# Altium schematic sheet _Geeky_ Sheet1 copy_2023-02-18.schdoc
size 440 x 310 mm
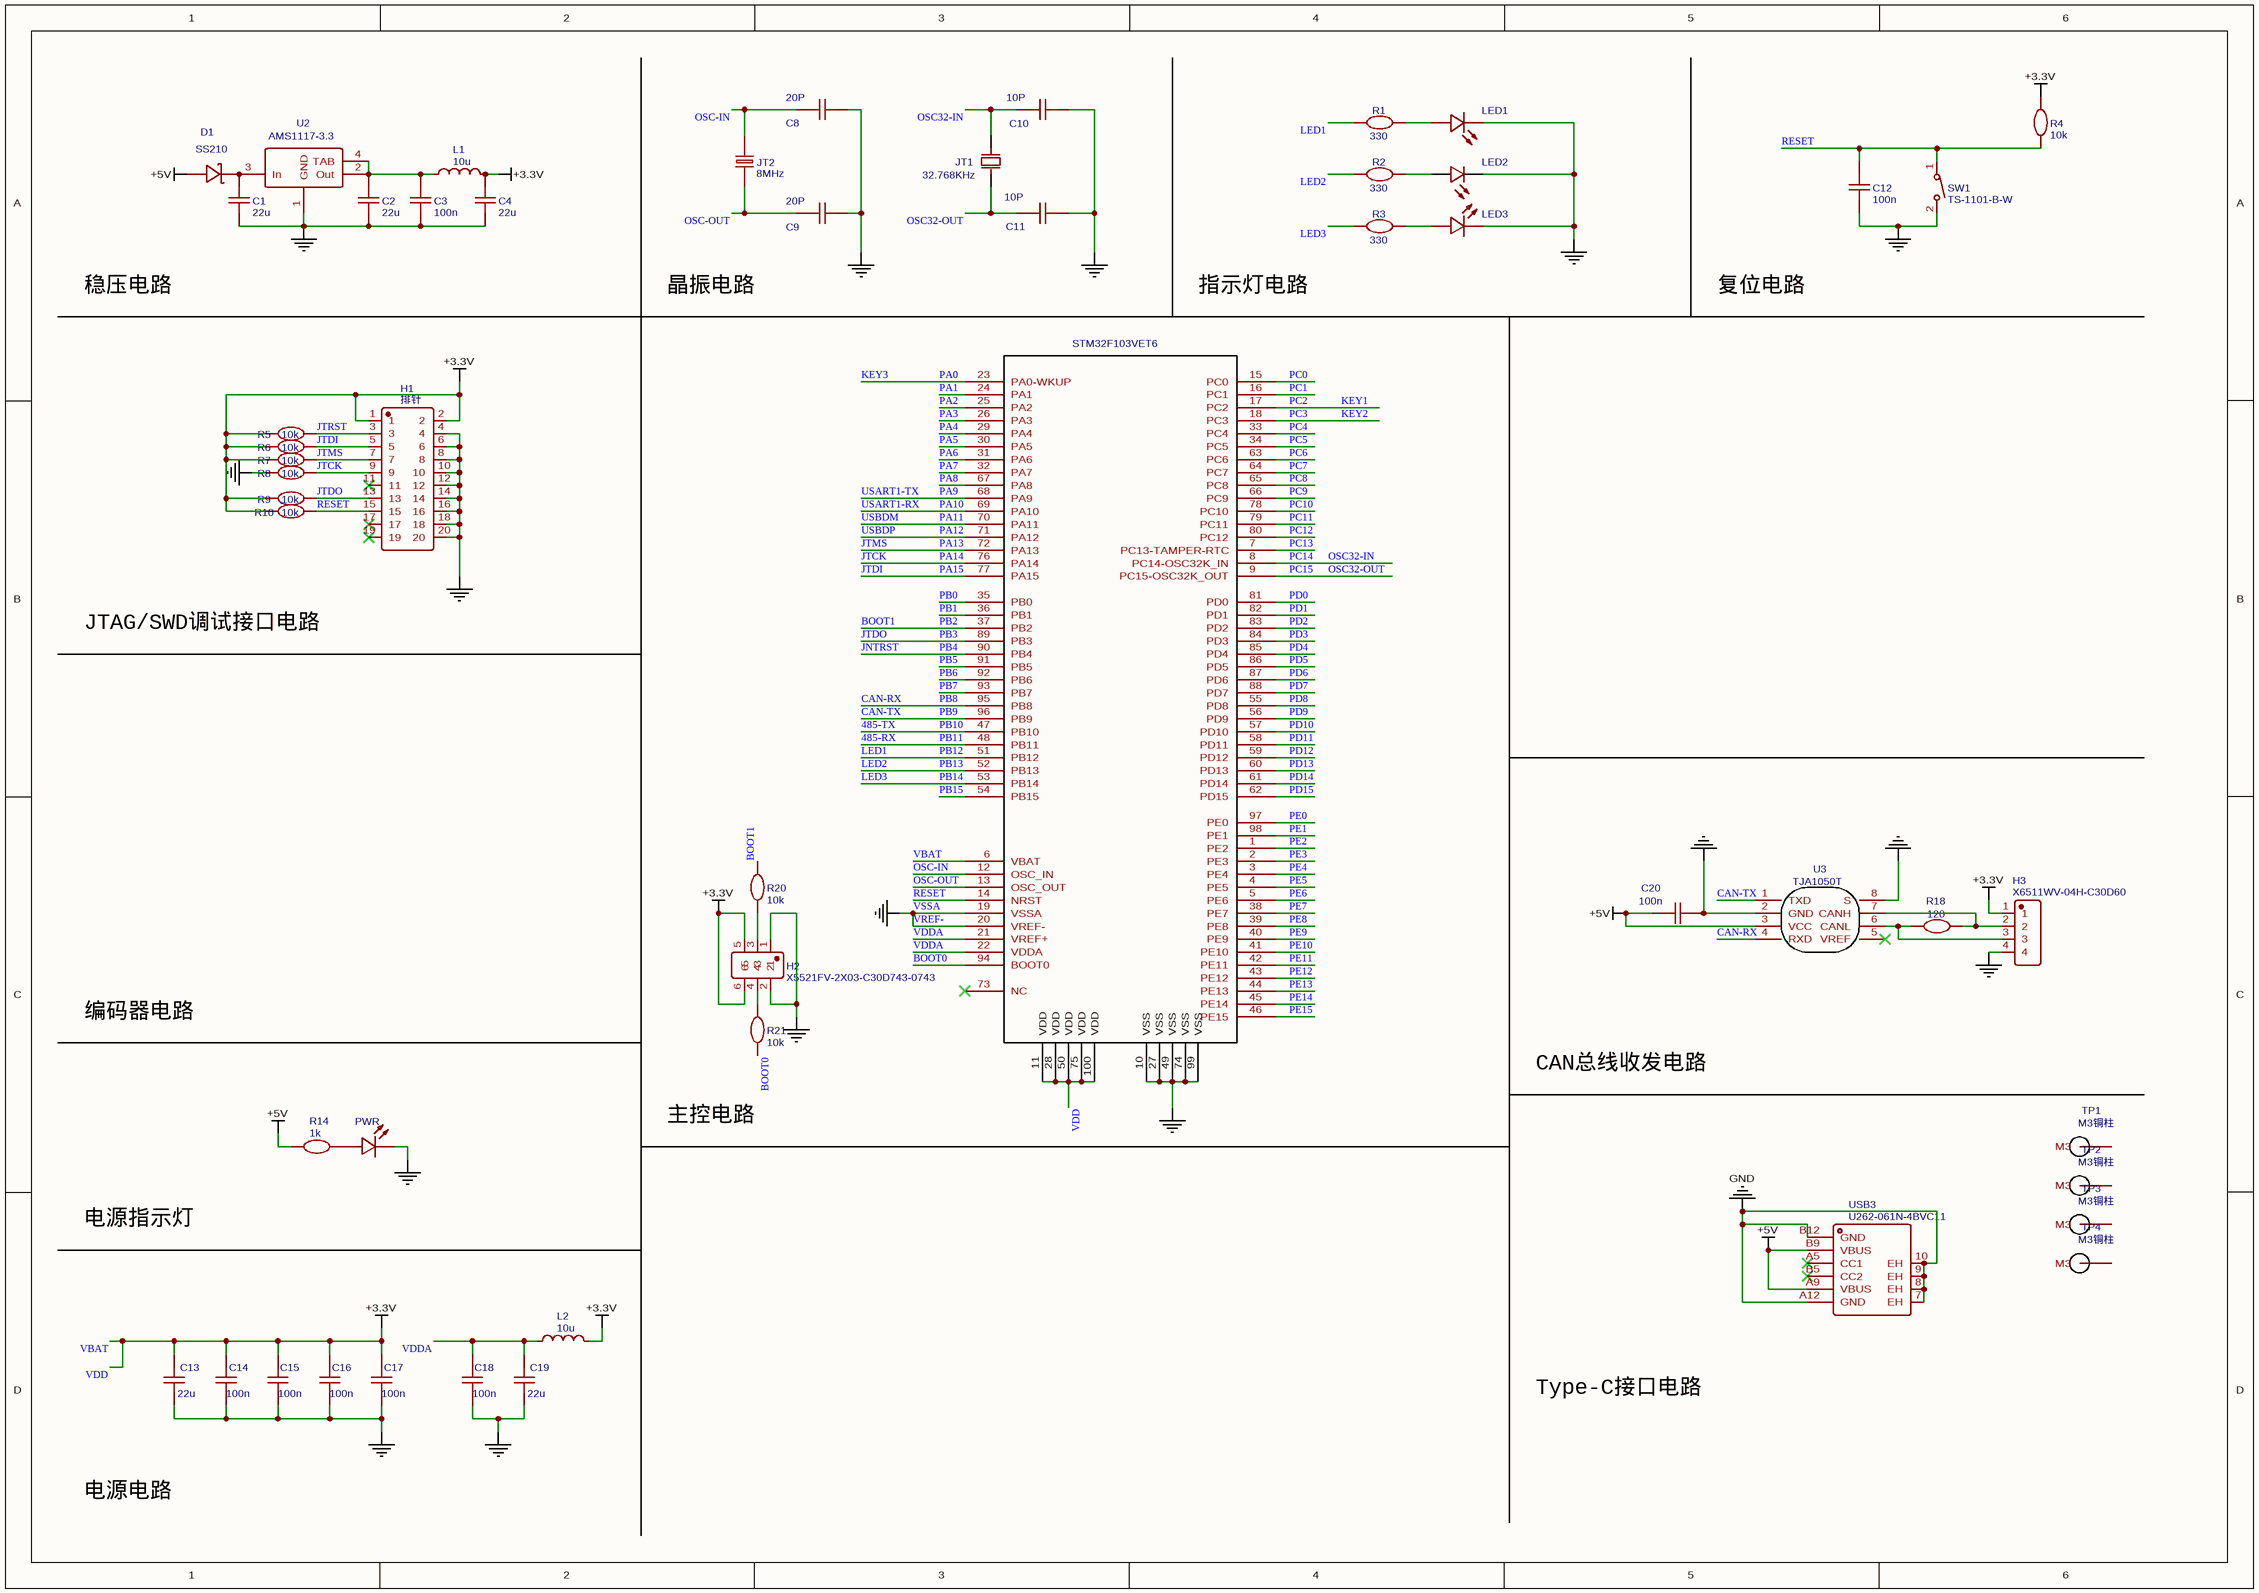
[diagram p0: _Geeky_ Sheet1 copy_2023-02-18.schdoc]

## Parts
C1  22u  [0805]
C2  22u  [0805]
C3  100n  [0805]
C4  22u  [0805]
C8  20P  [0805]
C9  20P  [0805]
C10  10P  [0805]
C11  10P  [0805]
C12  100n  [0805]
C13  22u  [0805]
C14  100n  [0805]
C15  100n  [0805]
C16  100n  [0805]
C17  100n  [0805]
C18  100n  [0805]
C19  22u  [0805]
C20  100n  [0805]
D1  SS210  [SMA_L4.3-W2.6-LS5.2-FD]
H1  排针  [HDR-TH_20P-P2.54-V-M-R2-C10-S2.54-3]
H2  X5521FV-2X03-C30D743-0743  [HDR-TH_6P-P2.54-V-F-R2-C3-S2.54-3]
H3  X6511WV-04H-C30D60  [HDR-TH_4P-P2.54-V-M]
JT1  32.768KHz  [OSC-SMD_L3.2-W1.5]
JT2  8MHz  [HC-49US_L11.5-W4.5-P4.88]
L1  10u  [0805]
L2  10u  [0805]
LED1  17-21SUYC/TR8  [LED0805-RD]  (value not drawn)
LED2  17-21/BHC-XL2M2TY/3T  [LED0805-RD]  (value not drawn)
LED3  D-W080508W1-KS2  [LED-0805]  (value not drawn)
PWR  17-21SURC/S530-A2/TR8  [LED-0805]  (value not drawn)
R1  330  [0805]
R2  330  [0805]
R3  330  [0805]
R4  10k  [0805]
R5  10k  [0805]
R6  10k  [0805]
R7  10k  [0805]
R8  10k  [0805]
R9  10k  [0805]
R10  10k  [0805]
R14  1k  [0805]
R18  120  [0805]
R20  10k  [0805]
R21  10k  [0805]
SW1  TS-1101-B-W  [KEY-SMD_2P-L6.0-W3.6-P7.4-LS8.0-L]
TP1  M3铜柱  [M3铜柱_LCEDA]
TP2  M3铜柱  [M3铜柱_LCEDA]
TP3  M3铜柱  [M3铜柱_LCEDA]
TP4  M3铜柱  [M3铜柱_LCEDA]
U1  STM32F103VET6  [LQFP-100_L14.0-W14.0-P0.50-LS16.0-BL]
U2  AMS1117-3.3  [SOT-223_L6.5-W3.5-P2.30-LS7.0-BR]
U3  TJA1050T  [SOIC-8_L5.0-W4.0-P1.27-LS6.0-BL]
USB3  U262-061N-4BVC11  [USB-SMD_U262-061N-4BVC11]

## Nets
+5V: C20.1 D1.1(A) R14.1 U3.3(VCC) USB3.A9(VBUS) USB3.B9(VBUS)
VBAT: C4.1 C13.2 C14.2 C15.2 C16.2 C17.2 H1.1 H1.2 H2.5 H2.6 H3.1 L1.2 L2.2 R4.2 R5.2 R6.2 R7.2 R9.2 R10.2 U1.6(VBAT) U1.11(VDD) U1.28(VDD) U1.50(VDD) U1.75(VDD) U1.100(VDD)  [also labelled +3.3V, VDD]
VREF-: C1.2 C2.2 C3.2 C4.2 C8.1 C9.1 C10.1 C11.1 C12.2 C13.1 C14.1 C15.1 C16.1 C17.1 C18.1 C19.1 C20.2 H1.4 H1.6 H1.8 H1.10 H1.12 H1.14 H1.16 H1.18 H1.20 H2.1 H2.2 H3.4 LED1.1(-) LED2.1(-) LED3.2(K) PWR.2(K) R8.2 SW1.2 U1.10(VSS) U1.19(VSSA) U1.20(VREF-) U1.27(VSS) U1.49(VSS) U1.74(VSS) U1.99(VSS) U2.1(GND) U3.2(GND) U3.8(S) USB3.7(EH) USB3.8(EH) USB3.9(EH) USB3.10(EH) USB3.A12(GND) USB3.B12(GND)  [also labelled GND, VSSA]
485-RX: U1.48(PB11)  [also labelled PB11]
485-TX: U1.47(PB10)  [also labelled PB10]
BOOT0: R21.1 U1.94(BOOT0)
BOOT1: R20.2 U1.37(PB2)  [also labelled PB2]
CAN-RX: U1.95(PB8) U3.4(RXD)  [also labelled PB8]
CAN-TX: U1.96(PB9) U3.1(TXD)  [also labelled PB9]
JNTRST: U1.90(PB4)  [also labelled PB4]
JTCK: H1.9 R8.1 U1.76(PA14)  [also labelled PA14]
JTDI: H1.5 R6.1 U1.77(PA15)  [also labelled PA15]
JTDO: H1.13 R9.1 U1.89(PB3)  [also labelled PB3]
JTMS: H1.7 R7.1 U1.72(PA13)  [also labelled PA13]
JTRST: H1.3 R5.1
KEY1: U1.17(PC2)  [also labelled PC2]
KEY2: U1.18(PC3)  [also labelled PC3]
KEY3: U1.23(PA0-WKUP)  [also labelled PA0]
LED1: R1.1 U1.51(PB12)  [also labelled PB12]
LED2: R2.1 U1.52(PB13)  [also labelled PB13]
LED3: R3.1 U1.53(PB14)  [also labelled PB14]
OSC32-IN: C10.2 JT1.2(OSC2) U1.8(PC14-OSC32K_IN)  [also labelled PC14]
OSC32-OUT: C11.2 JT1.1(OSC1) U1.9(PC15-OSC32K_OUT)  [also labelled PC15]
OSC-IN: C8.2 JT2.2 U1.12(OSC_IN)
OSC-OUT: C9.2 JT2.1 U1.13(OSC_OUT)
PA1: U1.24(PA1)
PA2: U1.25(PA2)
PA3: U1.26(PA3)
PA4: U1.29(PA4)
PA5: U1.30(PA5)
PA6: U1.31(PA6)
PA7: U1.32(PA7)
PA8: U1.67(PA8)
PA9: U1.68(PA9)  [also labelled USART1-TX]
PA10: U1.69(PA10)  [also labelled USART1-RX]
PA11: U1.70(PA11)  [also labelled USBDM]
PA12: U1.71(PA12)  [also labelled USBDP]
PB0: U1.35(PB0)
PB1: U1.36(PB1)
PB5: U1.91(PB5)
PB6: U1.92(PB6)
PB7: U1.93(PB7)
PB15: U1.54(PB15)
PC0: U1.15(PC0)
PC1: U1.16(PC1)
PC4: U1.33(PC4)
PC5: U1.34(PC5)
PC6: U1.63(PC6)
PC7: U1.64(PC7)
PC8: U1.65(PC8)
PC9: U1.66(PC9)
PC10: U1.78(PC10)
PC11: U1.79(PC11)
PC12: U1.80(PC12)
PC13: U1.7(PC13-TAMPER-RTC)
PD0: U1.81(PD0)
PD1: U1.82(PD1)
PD2: U1.83(PD2)
PD3: U1.84(PD3)
PD4: U1.85(PD4)
PD5: U1.86(PD5)
PD6: U1.87(PD6)
PD7: U1.88(PD7)
PD8: U1.55(PD8)
PD9: U1.56(PD9)
PD10: U1.57(PD10)
PD11: U1.58(PD11)
PD12: U1.59(PD12)
PD13: U1.60(PD13)
PD14: U1.61(PD14)
PD15: U1.62(PD15)
PE0: U1.97(PE0)
PE1: U1.98(PE1)
PE2: U1.1(PE2)
PE3: U1.2(PE3)
PE4: U1.3(PE4)
PE5: U1.4(PE5)
PE6: U1.5(PE6)
PE7: U1.38(PE7)
PE8: U1.39(PE8)
PE9: U1.40(PE9)
PE10: U1.41(PE10)
PE11: U1.42(PE11)
PE12: U1.43(PE12)
PE13: U1.44(PE13)
PE14: U1.45(PE14)
PE15: U1.46(PE15)
RESET: C12.1 H1.15 R4.1 R10.1 SW1.1 U1.14(NRST)
VDDA: C18.2 C19.2 L2.1 U1.21(VREF+) U1.22(VDDA)
NetC1_1: C1.1 D1.2(K) U2.3(In)
NetC2_1: C2.1 C3.1 L1.1 U2.2(Out) U2.4(TAB)
NetH2_3: H2.3 R20.1
NetH2_4: H2.4 R21.2
NetH3_2: H3.2 R18.2 U3.7(CANH)
NetH3_3: H3.3 R18.1 U3.6(CANL)
NetLED1_2: LED1.2(+) R1.2
NetLED2_2: LED2.2(+) R2.2
NetLED3_1: LED3.1(A) R3.2
NetPWR_1: PWR.1(A) R14.2

Not connected (* = marked no-connect by the designer): H1 11* 17* 19*; TP1 1(M3); TP2 1(M3); TP3 1(M3); TP4 1(M3); U1 73(NC)*; U3 5(VREF)*; USB3 A5(CC1)* B5(CC2)*

## Notes on the sheet
- 稳压电路
- 晶振电路
- 指示灯电路
- 复位电路
- JTAG/SWD调试接口电路
- 编码器电路
- CAN总线收发电路
- 主控电路
- 电源指示灯
- Type-C接口电路
- 电源电路

## Library data of the parts
C1 C2 C4 C13 C19 = 22u: nameAlias: Value(F); spicePre: C; spiceSymbolName: Cap_0805_US
C3 C12 C14-C18 C20 = 100n: nameAlias: Value(F); spicePre: C; spiceSymbolName: Cap_0805_US
C8 C9 = 20P: nameAlias: Value(F); spicePre: C; spiceSymbolName: Cap_0805_US
C10 C11 = 10P: nameAlias: Value(F); spicePre: C; spiceSymbolName: Cap_0805_US
D1 = SS210: BOM_Manufacturer: MDD; SMT Type: Basic; BOM_Supplier: LCSC; BOM_Manufacturer Part: SS210; BOM_LCSC Assembly: Yes; image: //image.lceda.cn/szlcsc/C14996.jpg; BOM_Supplier Part: C14996; spicePre: D; spiceSymbolName: SS210
H1 = X5521WV-2X10-C46D46-1220: BOM_Manufacturer: XKB Connectivity(中国星坤); Contributor: LCSC; BOM_Supplier: LCSC; BOM_Supplier Part: C2764589; BOM_Manufacturer Part: X5521WV-2X10-C46D46-1220; BOM_JLCPCB Part Class: Extended Part; spicePre: H; spiceSymbolName: X5521WV-2X10-C46D46-1220
H2 = X5521FV-2X03-C30D743-0743: BOM_Manufacturer: XKB Connectivity(中国星坤); Contributor: LCSC; BOM_Supplier: LCSC; BOM_Supplier Part: C2764576; BOM_Manufacturer Part: X5521FV-2X03-C30D743-0743; BOM_JLCPCB Part Class: Extended Part; spicePre: H; spiceSymbolName: X5521FV-2X03-C30D743-0743
H3 = X6511WV-04H-C30D60: BOM_Manufacturer: XKB Connectivity; Contributor: LCSC; BOM_Supplier: LCSC; BOM_Supplier Part: C706876; BOM_Manufacturer Part: X6511WV-04H-C30D60; BOM_JLCPCB Part Class: Extended Part; spicePre: H; spiceSymbolName: X6511WV-04H-C30D60
JT1 = 32.768KHz: BOM_Manufacturer: NDK; BOM_Manufacturer Part: NX3215SA 32.768KHZ 12.5PF 20PPM; nameAlias: Frequency; SMT Type: Extend; BOM_Supplier: LCSC; BOM_Supplier Part: C70509; BOM_LCSC Assembly: Yes; spicePre: X; spiceSymbolName: NX3215SA 32.768KHZ 12.5PF 20PPM
JT2 = 8MHz: BOM_Manufacturer: TAITIEN Elec; BOM_Manufacturer Part: XIHCELNANF-48MHZ; nameAlias: Frequency; Contributor: LCSC; BOM_Supplier: LCSC; BOM_Supplier Part: C295085; spicePre: X; spiceSymbolName: XIHCELNANF-48MHZ
L1 L2 = 10u: nameAlias: Value(H); spicePre: L; spiceSymbolName: Inductor_0805_US
LED1 = 17-21SUYC/TR8: BOM_Manufacturer: KENTO; SMT Type: Basic; BOM_Supplier: LCSC; BOM_Manufacturer Part: 17-21SUYC/TR8; BOM_LCSC Assembly: Yes; image: //image.lceda.cn/szlcsc/C2296.jpg; BOM_Supplier Part: C2296; spicePre: L; spiceSymbolName: 17-21SUYC/TR8
LED2 = 17-21/BHC-XL2M2TY/3T: BOM_Manufacturer: EVERLIGHT; SMT Type: Extend; BOM_Supplier: LCSC; BOM_Manufacturer Part: 17-21/BHC-XL2M2TY/3T; image: //image.lceda.cn/szlcsc/C72035.jpg; BOM_Supplier Part: C72035; BOM_LCSC Assembly: Yes; spicePre: L; spiceSymbolName: 17-21/BHC-XL2M2TY/3T
LED3 = D-W080508W1-KS2: BOM_Manufacturer: ARKLED; Contributor: LCSC; BOM_Supplier: LCSC; BOM_Manufacturer Part: D-W080508W1-KS2; BOM_Supplier Part: C130115; spicePre: L; spiceSymbolName: D-W080508W1-KS2
PWR = 17-21SURC/S530-A2/TR8: BOM_Manufacturer: EVERLIGHT; Contributor: LCSC; BOM_Supplier: LCSC; BOM_Manufacturer Part: 17-21SURC/S530-A2/TR8; BOM_Supplier Part: C131244; spicePre: L; spiceSymbolName: 17-21SURC/S530-A2/TR8
R1-R3 = 330: nameAlias: Value(Ω); spicePre: R; spiceSymbolName: Res_0805(1/8W)_EU
R4-R10 R20 R21 = 10k: nameAlias: Value(Ω); spicePre: R; spiceSymbolName: Res_0805(1/8W)_EU
R14 = 1k: nameAlias: Value(Ω); spicePre: R; spiceSymbolName: Res_0805(1/8W)_EU
R18 = 120: nameAlias: Value(Ω); spicePre: R; spiceSymbolName: Res_0805(1/8W)_EU
SW1 = TS-1101-B-W: BOM_Manufacturer: XKB Enterprise; Contributor: LCSC; BOM_Supplier: LCSC; BOM_Supplier Part: C500065; BOM_Manufacturer Part: TS-1101-B-W; BOM_JLCPCB Part Class: Extended Part; spicePre: S; spiceSymbolName: TS-1101-B-W
TP1-TP4 = M3铜柱: Contributor: LGW123456; BOM_Supplier: LCSC; spicePre: T; spiceSymbolName: M3铜柱
U1 = STM32F103VET6: BOM_Manufacturer: STMicroelectronics; SMT Type: Basic; BOM_Supplier: LCSC; BOM_Manufacturer Part: STM32F103VET6; BOM_LCSC Assembly: Yes; image: //image.lceda.cn/szlcsc/C8308.jpg; BOM_Supplier Part: C8308; spicePre: U; spiceSymbolName: STM32F103VET6
U2 = AMS1117-3.3: BOM_Manufacturer: SK; Contributor: LCSC; SMT Type: Extend; BOM_Supplier: LCSC; BOM_Supplier Part: C165482; BOM_Manufacturer Part: AMS1117-3.3; BOM_LCSC Assembly: Yes; spicePre: U; spiceSymbolName: AMS1117-3.3_C165482
U3 = TJA1050T: BOM_Manufacturer: NXP; BOM_Manufacturer Part: TJA1050T/CM,118; SMT Type: Basic; BOM_Supplier: LCSC; BOM_LCSC Assembly: Yes; image: //image.lceda.cn/szlcsc/C6952.jpg; BOM_Supplier Part: C6952; spicePre: U; spiceSymbolName: TJA1050T/CM,118
USB3 = U262-061N-4BVC11: BOM_Manufacturer: XKB Connectivity(中国星坤); Contributor: LCSC; BOM_Supplier: LCSC; BOM_Supplier Part: C2764612; BOM_Manufacturer Part: U262-061N-4BVC11; BOM_JLCPCB Part Class: Extended Part; spicePre: U; spiceSymbolName: U262-061N-4BVC11